# EAGLE schematic HW1_NathanDonaldson_U0632803 (EAGLE 7.7.0)
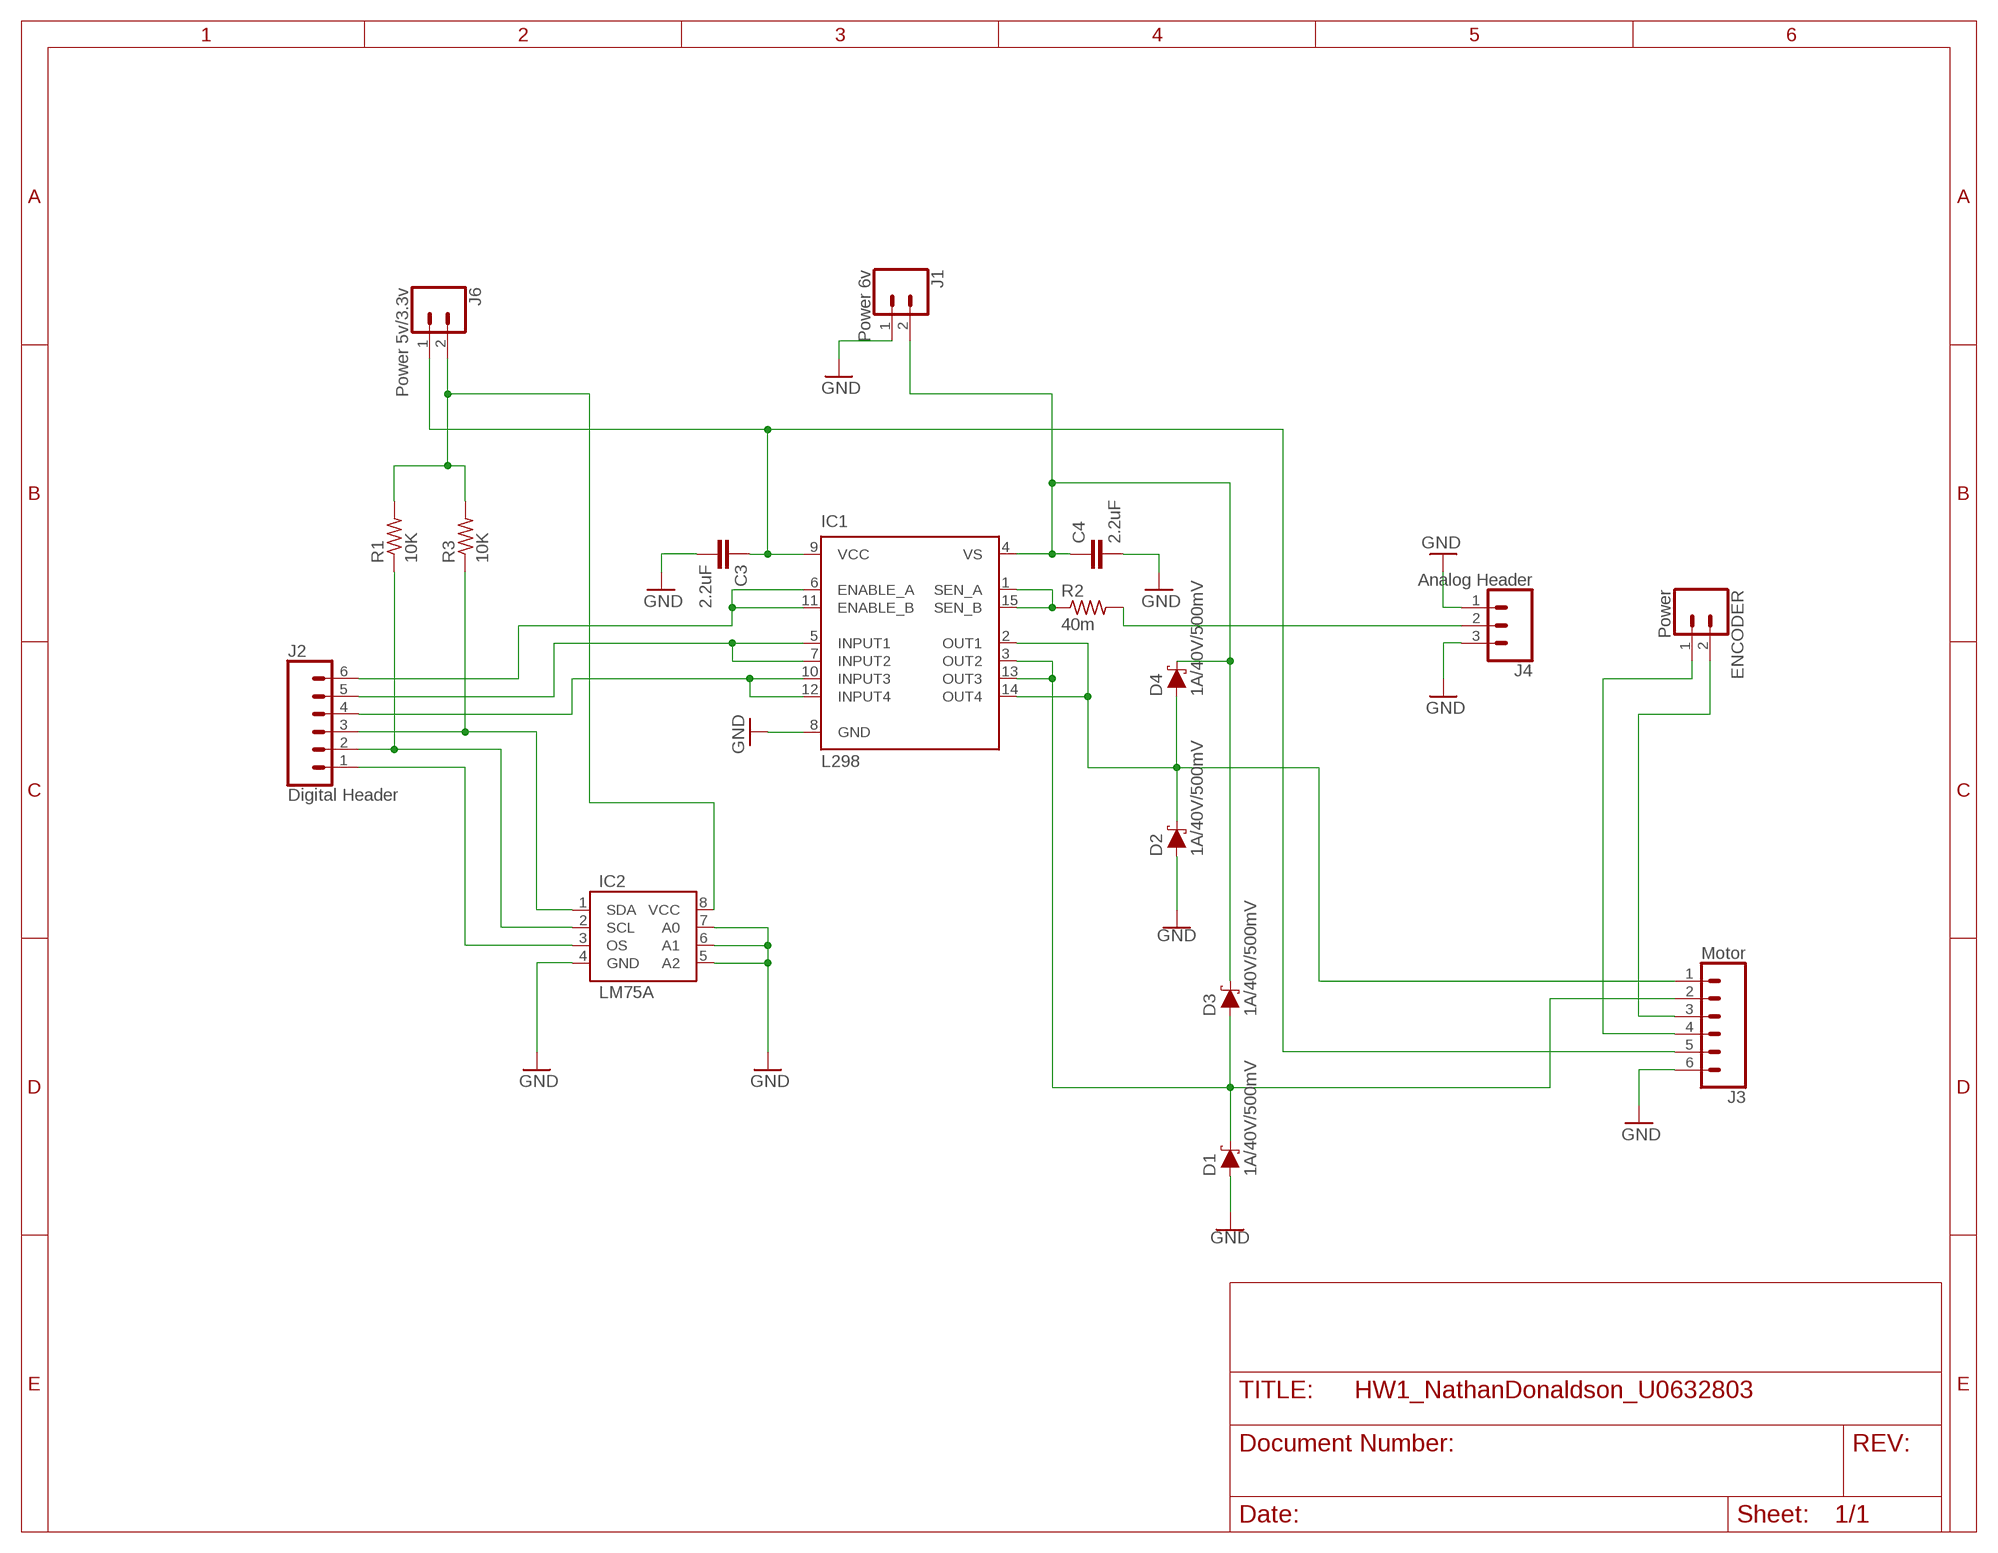
[diagram p0: schematic, sheet 1]

## Parts
C3  2.2uF  2.2UF-CERCAP-10009  [1206]
C4  2.2uF  2.2UF-CERCAP-10009  [1206]
D1  1A/40V/500mV  DIODE-SCHOTTKY-SS14  [SMA-DIODE]
D2  1A/40V/500mV  DIODE-SCHOTTKY-SS14  [SMA-DIODE]
D3  1A/40V/500mV  DIODE-SCHOTTKY-SS14  [SMA-DIODE]
D4  1A/40V/500mV  DIODE-SCHOTTKY-SS14  [SMA-DIODE]
ENCODER  Power  CONN_02  [1X02]
IC1  L298  [MULTIWATT-15]
IC2  LM75A  [SO8]
J1  Power 6v  CONN_02  [1X02]
J2  Digital Header  CONN_06LOCK  [1X06_LOCK]
J3  Motor  CONN_06LOCK  [1X06_LOCK]
J4  Analog Header  CONN_03  [1X03]
J6  Power 5v/3.3v  CONN_02  [1X02]
R1  10K  R-US_R1206  [R1206]
R2  40m  R-US_R1206  [R1206]
R3  10K  R-US_R1206  [R1206]

## Nets
GND: C3.2 C4.2 D1.A D2.A IC1.8(GND) IC2.4(GND) IC2.5(A2) IC2.6(A1) IC2.7(A0) J1.1 J3.6 J4.1 J4.3
N$1: J4.2 R2.2
N$2: ENCODER.2 J3.3
N$3: IC1.6(ENABLE_A) IC1.11(ENABLE_B) J2.6
N$4: ENCODER.1 J3.4
N$6: IC1.5(INPUT1) IC1.7(INPUT2) J2.5
N$7: IC1.10(INPUT3) IC1.12(INPUT4) J2.4
N$8: IC2.1(SDA) J2.3 R3.1
N$9: IC2.2(SCL) J2.2 R1.1
N$10: IC2.3(OS) J2.1
N$11: IC2.8(VCC) J6.2 R1.2 R3.2
N$12: IC1.1(SEN_A) IC1.15(SEN_B) R2.1
N$13: C3.1 IC1.9(VCC) J3.5 J6.1
N$16: D2.C D4.A IC1.2(OUT1) IC1.14(OUT4) J3.1
N$17: D1.C D3.A IC1.3(OUT2) IC1.13(OUT3) J3.2
N$19: C4.1 D3.C D4.C IC1.4(VS) J1.2

## Library data of the parts
C3 C4 = SparkFun-Retired:2.2UF-CER: 2.2uF Ceramic SMT CAP-07888- 10V, 20% (0603) CAP-10009- 50V, 10% (1206); PROD_ID: CAP-10009
D1-D4 = SparkFun-DiscreteSemi:DIODE-SCHOTTKY: Schottky diode A Schottky diode is a semiconductor diode which has a low forward voltage drop and a very fast switching action.; PROD_ID: DIO-08053
ENCODER J1 J6 = SparkFun-Connectors:CONN_02: Multi connection point. Often used as Generic Header-pin footprint for 0.1 inch spaced/style header connections On any of the 0.1 inch spaced packages, you can populate with these: Break Away Headers - Straight <https://www.sparkfun.com/products/116> (PRT-00116) Break Away Male Headers - Right Angle <https://www.sparkfun.com/products/553> (PRT-00553) Female Headers <https://www.sparkfun.com/products/115> (PRT-00115) Break Away Headers - Machine Pin <https://www.sparkfun.com/products/117> (PRT-00117) Break Away Female Headers - Swiss Machine Pin <https://www.sparkfun.com/products/743> (PRT-00743) For SCREWTERMINALS and SPRING TERMINALS visit here: Screw Terimnals on SparkFun.com <https://www.sparkfun.com/search/results?term=Screw+Terminals> (5mm/3.5mm/2.54mm spacing) This device is also useful as a general connection point to wire up your design to another part of your project. Our various solder wires solder well into these plated through hole pads. Hook-Up Wire - Assortment (Stranded, 22 AWG) <https://www.sparkfun.com/products/11375> (PRT-11375) Hook-Up Wire - Assortment (Solid Core, 22 AWG) <https://www.sparkfun.com/products/11367> (PRT-11367) View the entire wire category on our website here <https://www.sparkfun.com/categories/141> Special notes: Molex polarized connector foot print use with: PRT-08233 with associated crimp pins and housings. 2.54_SCREWTERM for use with PRT-10571. 3.5mm Screw Terminal footprints for PRT-08084 5mm Screw Terminal footprints for use with PRT-08432
IC1 = st-microelectronics:L298: DUAL FULL-BRIDGE DRIVER; MPN: L298N; OC_FARNELL: 1589425; OC_NEWARK: 32M1527
IC2 = nxp:LM75A
J2 J3 = SparkFun-Connectors:CONN_06: Multi connection point. Often used as Generic Header-pin footprint for 0.1 inch spaced/style header connections On any of the 0.1 inch spaced packages, you can populate with these: Break Away Headers - Straight <https://www.sparkfun.com/products/116> (PRT-00116) Break Away Male Headers - Right Angle <https://www.sparkfun.com/products/553> (PRT-00553) Female Headers <https://www.sparkfun.com/products/115> (PRT-00115) Break Away Headers - Machine Pin <https://www.sparkfun.com/products/117> (PRT-00117) Break Away Female Headers - Swiss Machine Pin <https://www.sparkfun.com/products/743> (PRT-00743) Arduino Stackable Header - 6 Pin <https://www.sparkfun.com/products/9280> (PRT-09280) For SCREWTERMINALS and SPRING TERMINALS visit here: Screw Terimnals on SparkFun.com <https://www.sparkfun.com/search/results?term=Screw+Terminals> (5mm/3.5mm/2.54mm spacing) This device is also useful as a general connection point to wire up your design to another part of your project. Our various solder wires solder well into these plated through hole pads. Hook-Up Wire - Assortment (Stranded, 22 AWG) <https://www.sparkfun.com/products/11375> (PRT-11375) Hook-Up Wire - Assortment (Solid Core, 22 AWG) <https://www.sparkfun.com/products/11367> (PRT-11367) View the entire wire category on our website here <https://www.sparkfun.com/categories/141>
J4 = SparkFun-Connectors:CONN_03: Multi connection point. Often used as Generic Header-pin footprint for 0.1 inch spaced/style header connections On any of the 0.1 inch spaced packages, you can populate with these: Break Away Headers - Straight <https://www.sparkfun.com/products/116> (PRT-00116) Break Away Male Headers - Right Angle <https://www.sparkfun.com/products/553> (PRT-00553) Female Headers <https://www.sparkfun.com/products/115> (PRT-00115) Break Away Headers - Machine Pin <https://www.sparkfun.com/products/117> (PRT-00117) Break Away Female Headers - Swiss Machine Pin <https://www.sparkfun.com/products/743> (PRT-00743) Stackable Header - 3 Pin (Female, 0.1") <https://www.sparkfun.com/products/13875> (PRT-13875) For SCREWTERMINALS and SPRING TERMINALS visit here: Screw Terimnals on SparkFun.com <https://www.sparkfun.com/search/results?term=Screw+Terminals> (5mm/3.5mm/2.54mm spacing) This device is also useful as a general connection point to wire up your design to another part of your project. Our various solder wires solder well into these plated through hole pads. Hook-Up Wire - Assortment (Stranded, 22 AWG) <https://www.sparkfun.com/products/11375> (PRT-11375) Hook-Up Wire - Assortment (Solid Core, 22 AWG) <https://www.sparkfun.com/products/11367> (PRT-11367) View the entire wire category on our website here <https://www.sparkfun.com/categories/141> Special notes: Molex polarized connector foot print use with SKU : PRT-08232 with associated crimp pins and housings.
R1-R3 = rcl:R-US_: RESISTOR, American symbol